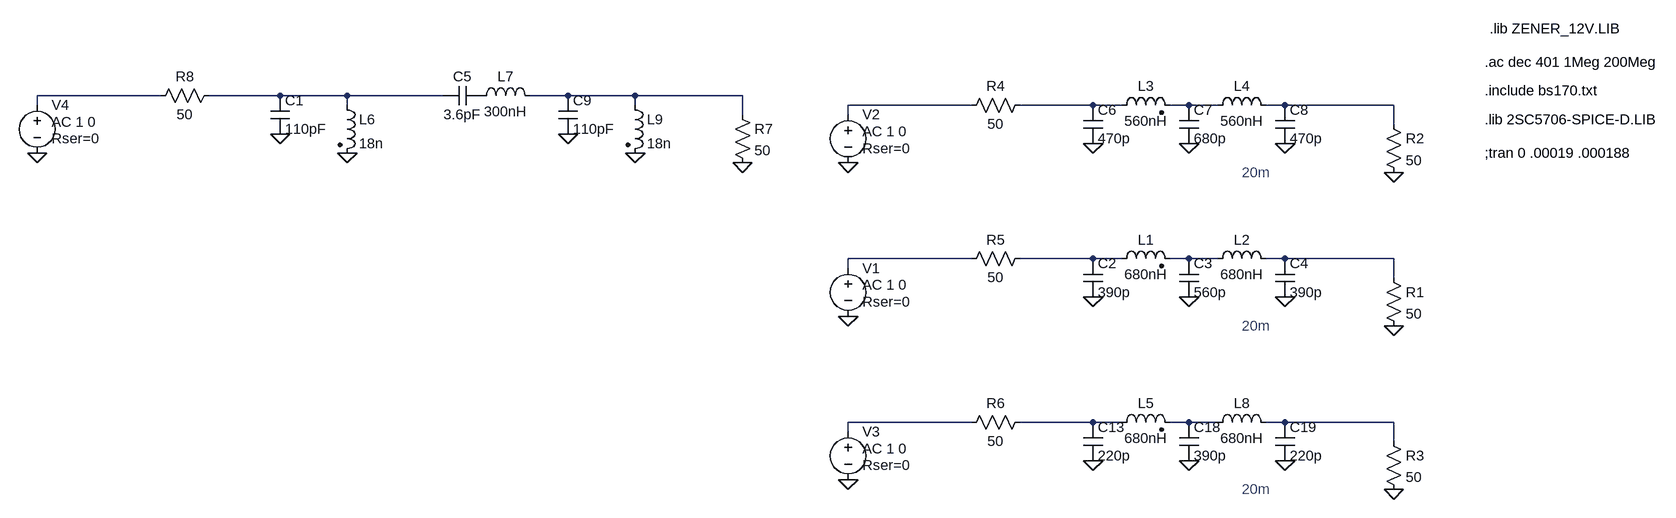
[diagram p0: schematic Low Pass.asc]
Low Pass.asc, the LTspice schematic file:
Version 4
SHEET 1 3764 1240
WIRE -6224 -3328 -6480 -3328
WIRE -6000 -3328 -6144 -3328
WIRE -5888 -3328 -6000 -3328
WIRE -5728 -3328 -5888 -3328
WIRE -5520 -3328 -5584 -3328
WIRE -5408 -3328 -5520 -3328
WIRE -5184 -3328 -5408 -3328
WIRE -6480 -3312 -6480 -3328
WIRE -5888 -3312 -5888 -3328
WIRE -5408 -3312 -5408 -3328
WIRE -4752 -3312 -5008 -3312
WIRE -4528 -3312 -4672 -3312
WIRE -4480 -3312 -4528 -3312
WIRE -4368 -3312 -4400 -3312
WIRE -4320 -3312 -4368 -3312
WIRE -4208 -3312 -4240 -3312
WIRE -3840 -3312 -4208 -3312
WIRE -5184 -3296 -5184 -3328
WIRE -5008 -3296 -5008 -3312
WIRE -3840 -3280 -3840 -3312
WIRE -4752 -3056 -5008 -3056
WIRE -4528 -3056 -4672 -3056
WIRE -4480 -3056 -4528 -3056
WIRE -4368 -3056 -4400 -3056
WIRE -4320 -3056 -4368 -3056
WIRE -4208 -3056 -4240 -3056
WIRE -3840 -3056 -4208 -3056
WIRE -5008 -3040 -5008 -3056
WIRE -3840 -3024 -3840 -3056
WIRE -4752 -2768 -5008 -2768
WIRE -4528 -2768 -4672 -2768
WIRE -4480 -2768 -4528 -2768
WIRE -4368 -2768 -4400 -2768
WIRE -4320 -2768 -4368 -2768
WIRE -4208 -2768 -4240 -2768
WIRE -3840 -2768 -4208 -2768
WIRE -5008 -2752 -5008 -2768
WIRE -3840 -2736 -3840 -2768
FLAG -3840 -2656 0
FLAG -4528 -2704 0
FLAG -4368 -2704 0
FLAG -4208 -2704 0
FLAG -5008 -2672 0
FLAG -3840 -2944 0
FLAG -4528 -2992 0
FLAG -4368 -2992 0
FLAG -4208 -2992 0
FLAG -5008 -2960 0
FLAG -3840 -3200 0
FLAG -4528 -3248 0
FLAG -4368 -3248 0
FLAG -4208 -3248 0
FLAG -5008 -3216 0
FLAG -5184 -3216 0
FLAG -6480 -3232 0
FLAG -6000 -3264 0
FLAG -5888 -3232 0
FLAG -5520 -3264 0
FLAG -5408 -3232 0
SYMBOL res -3856 -2752 R0
SYMATTR InstName R3
SYMATTR Value 50
SYMBOL cap -4544 -2768 R0
SYMATTR InstName C13
SYMATTR Value 220p
SYMBOL cap -4384 -2768 R0
SYMATTR InstName C18
SYMATTR Value 390p
SYMBOL cap -4224 -2768 R0
SYMATTR InstName C19
SYMATTR Value 220p
SYMBOL ind2 -4496 -2752 R270
WINDOW 0 32 56 VTop 2
WINDOW 3 5 56 VBottom 2
SYMATTR InstName L5
SYMATTR Value 680nH
SYMATTR Type ind
SYMBOL ind -4336 -2752 R270
WINDOW 0 32 56 VTop 2
WINDOW 3 5 56 VBottom 2
SYMATTR InstName L8
SYMATTR Value 680nH
SYMBOL voltage -5008 -2768 R0
WINDOW 123 24 44 Left 2
WINDOW 39 24 72 Left 2
SYMATTR Value2 AC 1 0
SYMATTR SpiceLine Rser=0
SYMATTR InstName V3
SYMATTR Value ""
SYMBOL res -3856 -3040 R0
SYMATTR InstName R1
SYMATTR Value 50
SYMBOL cap -4544 -3056 R0
SYMATTR InstName C2
SYMATTR Value 390p
SYMBOL cap -4384 -3056 R0
SYMATTR InstName C3
SYMATTR Value 560p
SYMBOL cap -4224 -3056 R0
SYMATTR InstName C4
SYMATTR Value 390p
SYMBOL ind2 -4496 -3040 R270
WINDOW 0 32 56 VTop 2
WINDOW 3 5 56 VBottom 2
SYMATTR InstName L1
SYMATTR Value 680nH
SYMATTR Type ind
SYMBOL ind -4336 -3040 R270
WINDOW 0 32 56 VTop 2
WINDOW 3 5 56 VBottom 2
SYMATTR InstName L2
SYMATTR Value 680nH
SYMBOL voltage -5008 -3056 R0
WINDOW 123 24 44 Left 2
WINDOW 39 24 72 Left 2
SYMATTR Value2 AC 1 0
SYMATTR SpiceLine Rser=0
SYMATTR InstName V1
SYMATTR Value ""
SYMBOL res -3856 -3296 R0
SYMATTR InstName R2
SYMATTR Value 50
SYMBOL cap -4544 -3312 R0
SYMATTR InstName C6
SYMATTR Value 470p
SYMBOL cap -4384 -3312 R0
SYMATTR InstName C7
SYMATTR Value 680p
SYMBOL cap -4224 -3312 R0
SYMATTR InstName C8
SYMATTR Value 470p
SYMBOL ind2 -4496 -3296 R270
WINDOW 0 32 56 VTop 2
WINDOW 3 5 56 VBottom 2
SYMATTR InstName L3
SYMATTR Value 560nH
SYMATTR Type ind
SYMBOL ind -4336 -3296 R270
WINDOW 0 32 56 VTop 2
WINDOW 3 5 56 VBottom 2
SYMATTR InstName L4
SYMATTR Value 560nH
SYMBOL voltage -5008 -3312 R0
WINDOW 123 24 44 Left 2
WINDOW 39 24 72 Left 2
SYMATTR Value2 AC 1 0
SYMATTR SpiceLine Rser=0
SYMATTR InstName V2
SYMATTR Value ""
SYMBOL res -4656 -3328 R90
WINDOW 0 0 56 VBottom 2
WINDOW 3 32 56 VTop 2
SYMATTR InstName R4
SYMATTR Value 50
SYMBOL res -4656 -3072 R90
WINDOW 0 0 56 VBottom 2
WINDOW 3 32 56 VTop 2
SYMATTR InstName R5
SYMATTR Value 50
SYMBOL res -4656 -2784 R90
WINDOW 0 0 56 VBottom 2
WINDOW 3 32 56 VTop 2
SYMATTR InstName R6
SYMATTR Value 50
SYMBOL res -5200 -3312 R0
SYMATTR InstName R7
SYMATTR Value 50
SYMBOL cap -6016 -3328 R0
SYMATTR InstName C1
SYMATTR Value 110pF
SYMBOL ind2 -5904 -3328 R0
SYMATTR InstName L6
SYMATTR Value 18n
SYMATTR Type ind
SYMBOL ind -5680 -3312 R270
WINDOW 0 32 56 VTop 2
WINDOW 3 5 56 VBottom 2
SYMATTR InstName L7
SYMATTR Value 300nH
SYMBOL voltage -6480 -3328 R0
WINDOW 123 24 44 Left 2
WINDOW 39 24 72 Left 2
SYMATTR Value2 AC 1 0
SYMATTR SpiceLine Rser=0
SYMATTR InstName V4
SYMATTR Value ""
SYMBOL res -6128 -3344 R90
WINDOW 0 0 56 VBottom 2
WINDOW 3 32 56 VTop 2
SYMATTR InstName R8
SYMATTR Value 50
SYMBOL cap -5664 -3344 R90
WINDOW 0 0 32 VBottom 2
WINDOW 3 32 32 VTop 2
SYMATTR InstName C5
SYMATTR Value 3.6pF
SYMBOL cap -5536 -3328 R0
SYMATTR InstName C9
SYMATTR Value 110pF
SYMBOL ind2 -5424 -3328 R0
SYMATTR InstName L9
SYMATTR Value 18n
SYMATTR Type ind
TEXT -3488 -3288 Left 2 !.lib 2SC5706-SPICE-D.LIB
TEXT -3488 -3232 Left 2 !;tran 0 .00019 .000188
TEXT -3488 -3336 Left 2 !.include bs170.txt
TEXT -3480 -3440 Left 2 !.lib ZENER_12V.LIB
TEXT -3488 -3384 Left 2 !.ac dec 401 1Meg 200Meg
TEXT -4280 -2656 Left 2 ;20m
TEXT -4280 -2944 Left 2 ;20m
TEXT -4280 -3200 Left 2 ;20m

The netlist it stands for:
* Low Pass.asc
R3 N015 0 50
C13 N013 0 220p
C18 N014 0 390p
C19 N015 0 220p
L5 N013 N014 680nH
L8 N014 N015 680nH
V3 N012 0 AC 1 0 Rser=0
R1 N011 0 50
C2 N009 0 390p
C3 N010 0 560p
C4 N011 0 390p
L1 N009 N010 680nH
L2 N010 N011 680nH
V1 N008 0 AC 1 0 Rser=0
R2 N007 0 50
C6 N005 0 470p
C7 N006 0 680p
C8 N007 0 470p
L3 N005 N006 560nH
L4 N006 N007 560nH
V2 N004 0 AC 1 0 Rser=0
R4 N005 N004 50
R5 N009 N008 50
R6 N013 N012 50
R7 N003 0 50
C1 N002 0 110pF
L6 N002 0 18n
L7 P001 N003 300nH
V4 N001 0 AC 1 0 Rser=0
R8 N002 N001 50
C5 P001 N002 3.6pF
C9 N003 0 110pF
L9 N003 0 18n
.lib 2SC5706-SPICE-D.LIB
;tran 0 .00019 .000188
.include bs170.txt
.lib ZENER_12V.LIB
.ac dec 401 1Meg 200Meg
* 20m
* 20m
* 20m
.backanno
.end